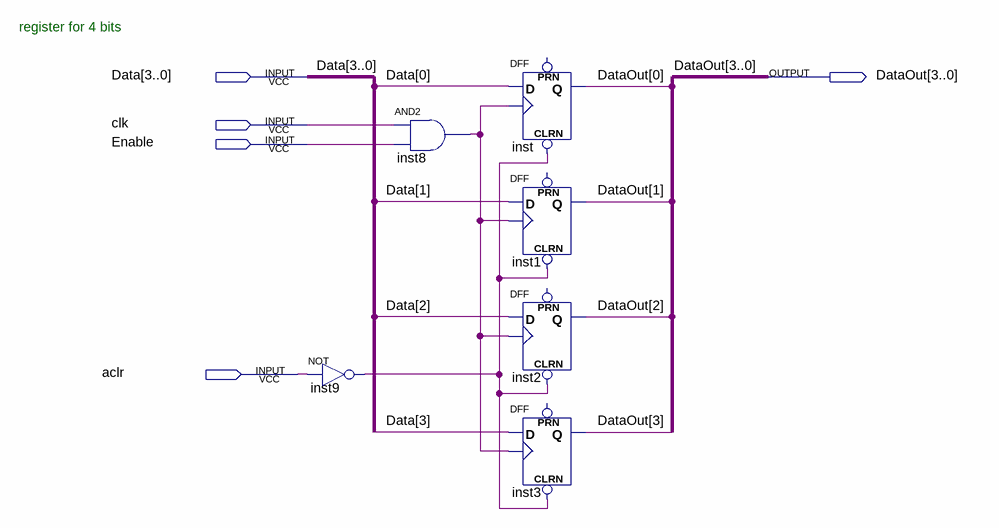
[diagram p0: schematic sheet]
// Quartus schematic reg4.bdf as structural Verilog: 6 symbols, 5 pins
module reg4 (
  input  [3:0] Data,
  input  clk,
  input  Enable,
  input  aclr,
  output [3:0] DataOut
);

  wire inst8_out, inst9_out;

  not inst9 (inst9_out, aclr);
  and inst8 (inst8_out, clk, Enable);
  DFF inst (.CLRN(inst9_out), .CLK(inst8_out), .D(Data[0]), .Q(DataOut[0]));  // open: PRN
  DFF inst1 (.CLRN(inst9_out), .CLK(inst8_out), .D(Data[1]), .Q(DataOut[1]));  // open: PRN
  DFF inst2 (.CLRN(inst9_out), .CLK(inst8_out), .D(Data[2]), .Q(DataOut[2]));  // open: PRN
  DFF inst3 (.CLRN(inst9_out), .CLK(inst8_out), .D(Data[3]), .Q(DataOut[3]));  // open: PRN

  // Notes on the sheet:
  //   register for 4 bits
endmodule
